# EAGLE design riffle-MIN-D-ROUTED-GOODSTUFF (EAGLE 6.5.0)
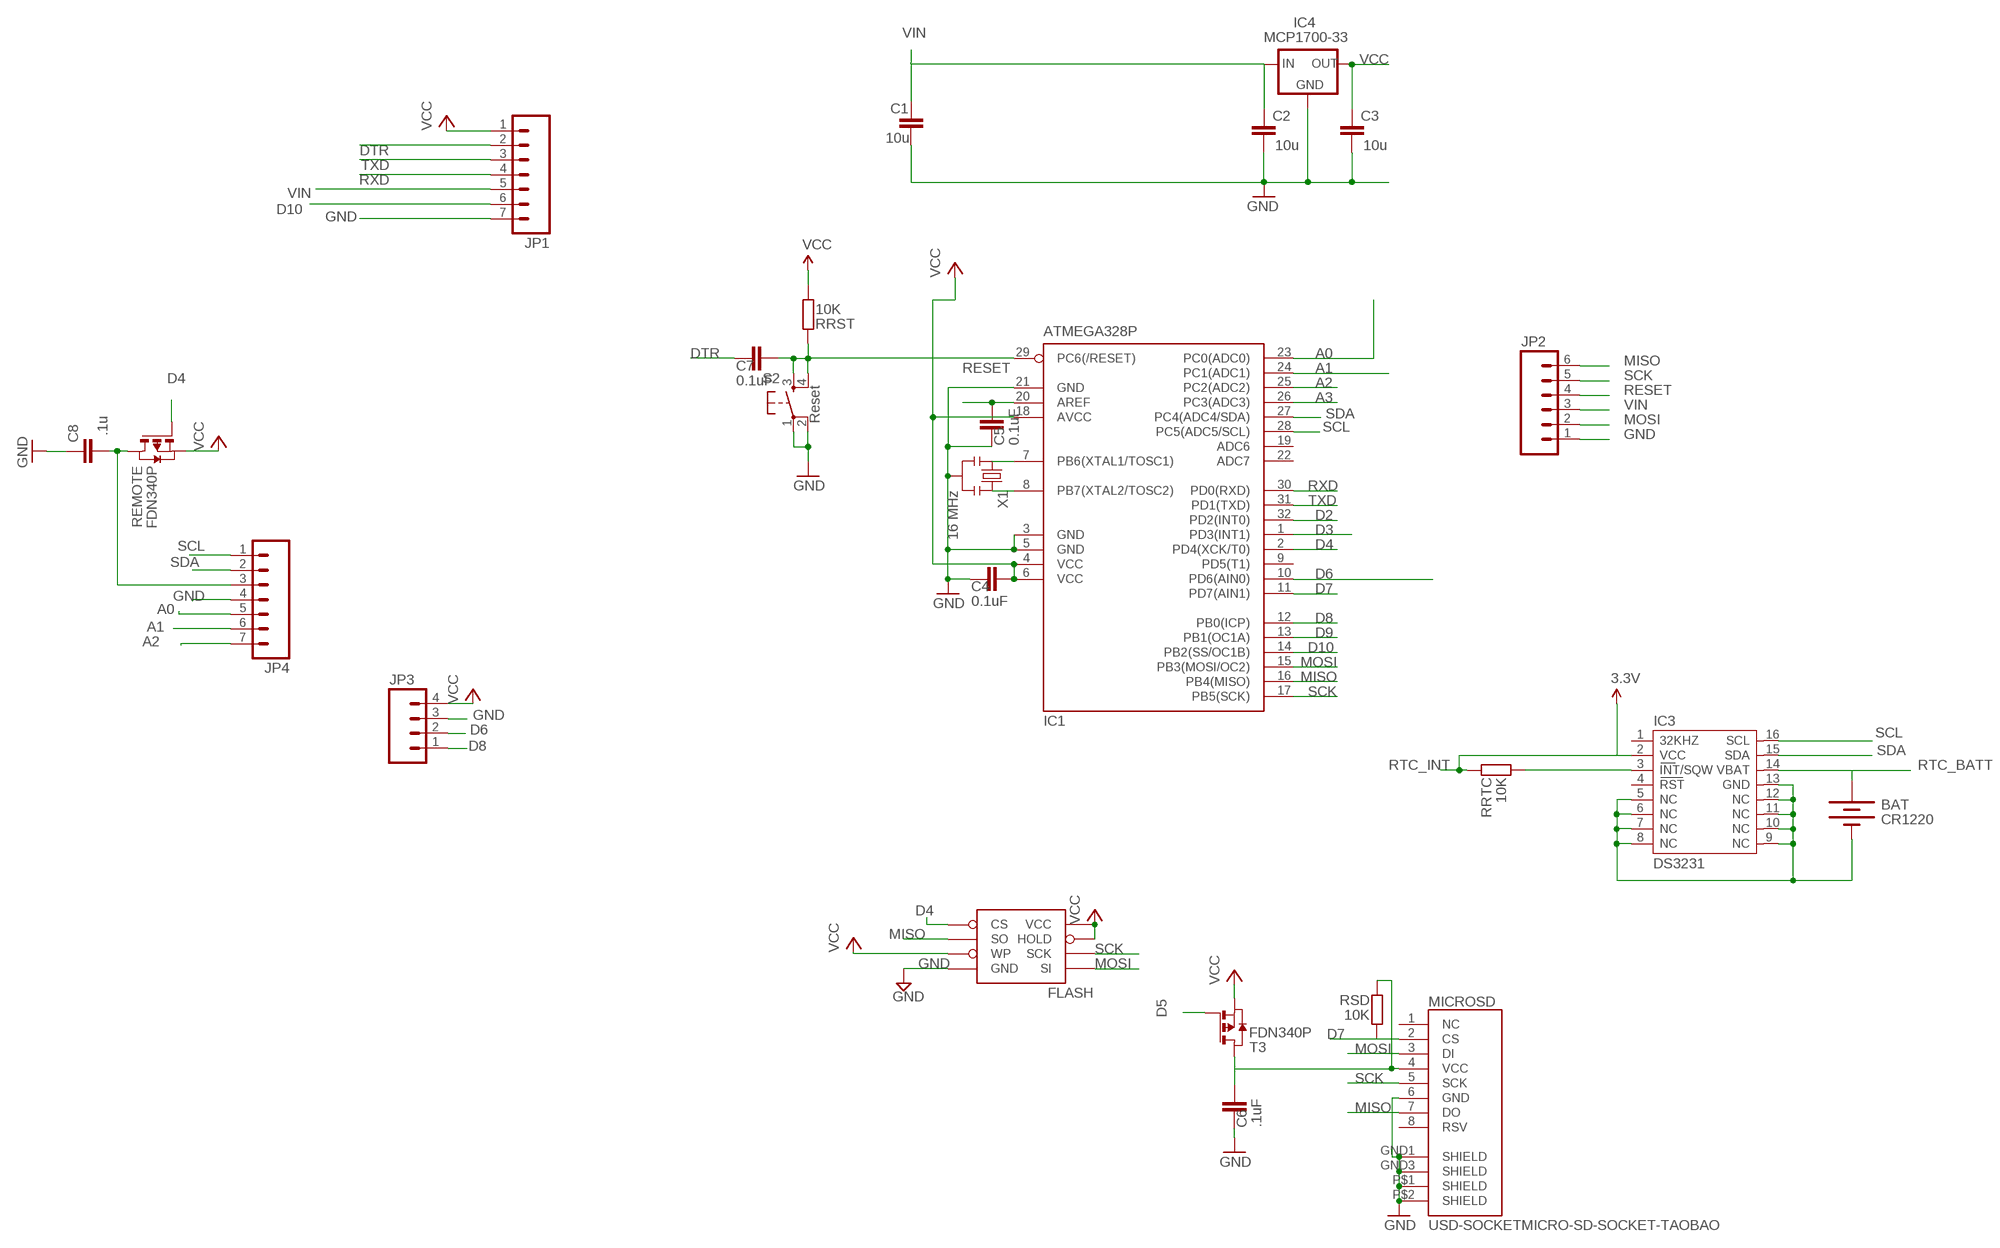
[diagram p0: schematic, sheet 1]

## Parts
BAT  CR1220  BATTERYBATTERY_12MM_SMT  [BATTCON_12MM_SMT]
C1  10u  C-EUC0805  [C0805]
C2  10u  C-EUC0805  [C0805]
C3  10u  C-EUC0805  [C0805]
C4  0.1uF  C-EUC0805  [C0805@1]
C5  0.1uF  C-EUC0805  [C0805@1]
C6  .1uF  C-EUC0805  [C0805@1]
C7  0.1uF  C-EUC0805  [C0805@1]
C8  .1u  C-EUC0805  [C0805]
FLASH  AT25F512BWIDE_5.3MM  [SO08WIDE]
IC1  ATMEGA328P  MEGA8-AI  [TQFP32-08]
IC3  DS3231  [DS3231]
IC4  MCP1700-33  MCP1700SOT233  [SOT23]
JP1  M07  [1X07]
JP2  M06LOCK  [1X06_LOCK]
JP3  M04LOCK  [1X04_LOCK]
JP4  M07  [1X07]
MICROSD  USD-SOCKETMICRO-SD-SOCKET-TAOBAO  [MICRO-SD-SOCKET-TAOBAO]
REMOTE  FDN340P  PMOSSOT23  [SOT-23]
RRST  10K  R-EU_R0805  [R0805]
RRTC  10K  R-EU_R0805  [R0805]
RSD  10K  R-EU_R0805  [R0805]
S2  Reset  TAC_SWITCHSMD  [TACTILE_SWITCH_SMD]
T3  FDN340P  PMOSSOT23  [SOT-23]
X1  16 MHz  RESONATORSMD  [RESONATOR-SMD]

## Nets
A0: IC1.23(PC0(ADC0)) JP4.5
A1: IC1.24(PC1(ADC1)) JP4.6
A2: IC1.25(PC2(ADC2)) JP4.7
A3: IC1.26(PC3(ADC3))
AREF: C5.2 IC1.20(AREF)
D2: IC1.32(PD2(INT0))
D3: IC1.1(PD3(INT1))
D4: FLASH.1(CS) IC1.2(PD4(XCK/T0)) REMOTE.3(G)
D5: T3.3(G)
D6: IC1.10(PD6(AIN0)) JP3.2
D7: IC1.11(PD7(AIN1)) MICROSD.2(CS) RSD.1
D8: IC1.12(PB0(ICP)) JP3.1
D9: IC1.13(PB1(OC1A))
D10: IC1.14(PB2(SS/OC1B)) JP1.6
DTR: C7.1 JP1.2
GND: BAT.P$1(-) C1.2 C2.2 C3.2 C4.1 C5.1 C6.1 C8.1 FLASH.4(GND) IC1.3(GND) IC1.5(GND) IC1.21(GND) IC3.5(NC) IC3.6(NC) IC3.7(NC) IC3.8(NC) IC3.9(NC) IC3.10(NC) IC3.11(NC) IC3.12(NC) IC3.13(GND) IC4.1(GND) JP1.7 JP2.1 JP3.3 JP4.4 MICROSD.6(GND) MICROSD.GND1(SHIELD) MICROSD.GND3(SHIELD) MICROSD.P$1(SHIELD) MICROSD.P$2(SHIELD) S2.1 S2.2 X1.2
MISO: FLASH.2(SO) IC1.16(PB4(MISO)) JP2.6 MICROSD.7(DO)
MOSI: FLASH.5(SI) IC1.15(PB3(MOSI/OC2)) JP2.2 MICROSD.3(DI)
N$2: IC1.8(PB7(XTAL2/TOSC2)) X1.3
N$3: IC1.7(PB6(XTAL1/TOSC1)) X1.1
N$16: IC3.3(INT/SQW) RRTC.1
N$31: C6.2 MICROSD.4(VCC) RSD.2 T3.1(D)
RESET: IC1.29(PC6(/RESET)) JP2.4
RESET1: C7.2 RRST.2 S2.3 S2.4
RTC_BATT: BAT.P$2(+) IC3.14(VBAT)
RTC_INT: IC3.2(VCC) RRTC.2 ; supply symbol labelled 3.3V
RXD: IC1.30(PD0(RXD)) JP1.4
SCK: FLASH.6(SCK) IC1.17(PB5(SCK)) JP2.5 MICROSD.5(SCK)
SCL: IC1.28(PC5(ADC5/SCL)) IC3.16(SCL) JP4.1
SDA: IC1.27(PC4(ADC4/SDA)) IC3.15(SDA) JP4.2
TXD: IC1.31(PD1(TXD)) JP1.3
VCC: C3.1 C4.2 C8.2 FLASH.3(WP) FLASH.7(HOLD) FLASH.8(VCC) IC1.4(VCC) IC1.6(VCC) IC1.18(AVCC) IC4.2(OUT) JP1.1 JP3.4 JP4.3 REMOTE.1(D) REMOTE.2(S) RRST.1 T3.2(S)
VIN [power]: C1.1 C2.1 IC4.3(IN) JP1.5 JP2.3
Unconnected: IC1.9(PD5(T1)) IC1.19(ADC6) IC1.22(ADC7) IC3.1(32KHZ) IC3.4(RST) MICROSD.1(NC) MICROSD.8(RSV)

## Library data of the parts
BAT = SparkFunNew:BATTERY: Battery Holders Various common sizes : AA, AAA, 20mm coin cell and 12mm coin cell.
C1-C3 C8 = resistor:C-EU: CAPACITOR, European symbol
C4-C7 = rcl:C-EU: CAPACITOR, European symbol
FLASH = LowPowerLab:AT25F512B: 4-Mbit SPI flash memory
IC1 = atmel:MEGA8: MICROCONTROLLER 8 Kbytes FLASH, 1 kbytes SRAM, 512 bytes EEPROM, USART, 6-channel 10 bit ADC, 2-channel 8 bit ADC Pin compatible with Atmega48, ATMega88, ATMega168 Source: avr.lbr; MPN: ATMEGA8-16AU; OC_FARNELL: 9171371; OC_NEWARK: 73M8863
IC3 = _lh-library:DS3231
IC4 = adafruit:MCP1700: VOLTAGE REGULATOR
JP1 JP4 = SparkFun-Connectors:M07: Header 7 Standard 7-pin 0.1" header. Use with straight break away headers (SKU : PRT-00116), right angle break away headers (PRT-00553), swiss pins (PRT-00743), machine pins (PRT-00117), and female headers (PRT-00115). NOTES ON THE VARIANTS LOCK and LOCK_LONGPADS... This footprint was designed to help hold the alignment of a through-hole component (i.e. 7-pin header) while soldering it into place. You may notice that each hole has been shifted either up or down by 0.005 of an inch from it's more standard position (which is usually a perfectly straight line). This slight alteration caused the pins (the squares in the middle) to touch the edges of the holes. Because they are alternating, it causes a "brace" to hold the header in place. 0.005 has proven to be the perfect amount of "off-center" position when using our standard breakaway headers. Although looks a little odd when you look at the bare footprint, once you have a header in there, the alteration is very hard to notice. Also, if you push a header all the way into place, it is covered up entirely on the bottom side. This idea of altering the position of holes to aid alignment will be further integrated into the Sparkfun Library for other footprints. It can help hold any component with 3 or more connection pins.
JP2 = SparkFun-Connectors:M06: Header 6 Standard 6-pin 0.1" header. Use with straight break away headers (SKU : PRT-00116), right angle break away headers (PRT-00553), swiss pins (PRT-00743), machine pins (PRT-00117), and female headers (PRT-00115). Molex polarized connector foot print use with SKU : PRT-08094 with associated crimp pins and housings. NOTES ON THE VARIANTS LOCK and LOCK_LONGPADS... This footprint was designed to help hold the alignment of a through-hole component (i.e. 6-pin header) while soldering it into place. You may notice that each hole has been shifted either up or down by 0.005 of an inch from it's more standard position (which is a perfectly straight line). This slight alteration caused the pins (the squares in the middle) to touch the edges of the holes. Because they are alternating, it causes a "brace" to hold the component in place. 0.005 has proven to be the perfect amount of "off-center" position when using our standard breakaway headers. Although looks a little odd when you look at the bare footprint, once you have a header in there, the alteration is very hard to notice. Also,if you push a header all the way into place, it is covered up entirely on the bottom side. This idea of altering the position of holes to aid alignment will be further integrated into the Sparkfun Library for other footprints. It can help hold any component with 3 or more connection pins.
JP3 = SparkFun-Connectors:M04: Header 4 Standard 4-pin 0.1" header. Use with straight break away headers (SKU : PRT-00116), right angle break away headers (PRT-00553), swiss pins (PRT-00743), machine pins (PRT-00117), and female headers (PRT-00115). Molex polarized connector foot print use with SKU : PRT-08231 with associated crimp pins and housings. 1MM SMD Version SKU: PRT-10208
MICROSD = SparkFunNew:USD-SOCKET: microSD Socket Push-push type uSD socket. Schematic element and footprint production proven. Spark Fun Electronics SKU : PRT-00127. tDoc lines correctly indicate media card edge positions when inserting (unlocked, locked, depressed).
REMOTE T3 = zetex:PMOSSOT23: MOS FET
RRST RRTC RSD = rcl:R-EU_: RESISTOR, European symbol
S2 = SparkFun:TAC_SWITCH: Momentary Switch Button commonly used for reset or general input. Spark Fun Electronics SKU : COM-00097
X1 = SparkFun:RESONATOR: Resonator Small SMD resonator. This is the itty bitty 10/20MHz resonators with built in caps. CSTCE10M0G55 and CSTCE20M0V53. Footprint has been reviewed closely but hasn't been tested yet.

## Net classes
1 power: width 0.381 mm, clearance 0.254 mm

## Board
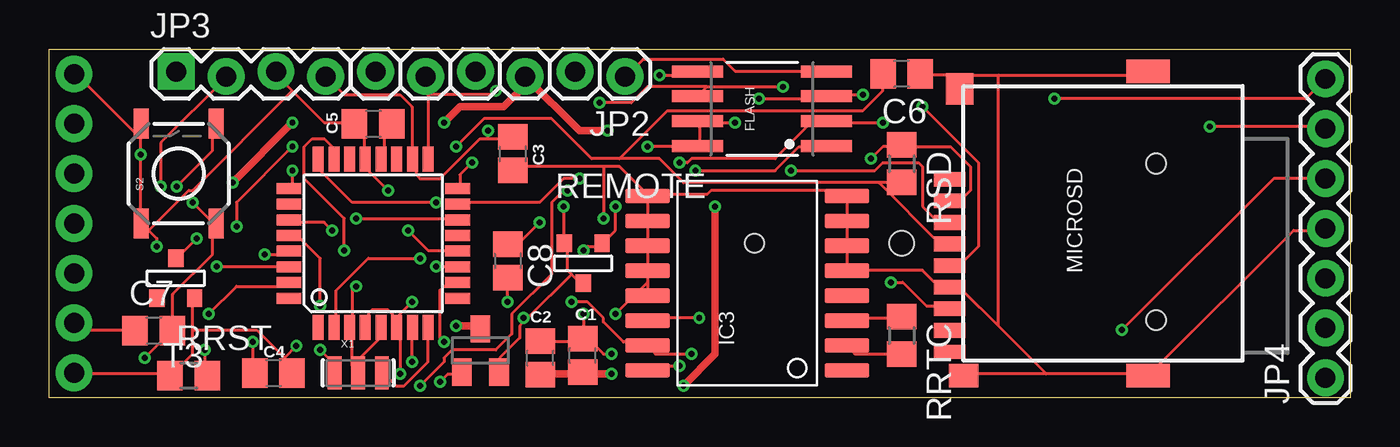
[diagram p1: board, top side]
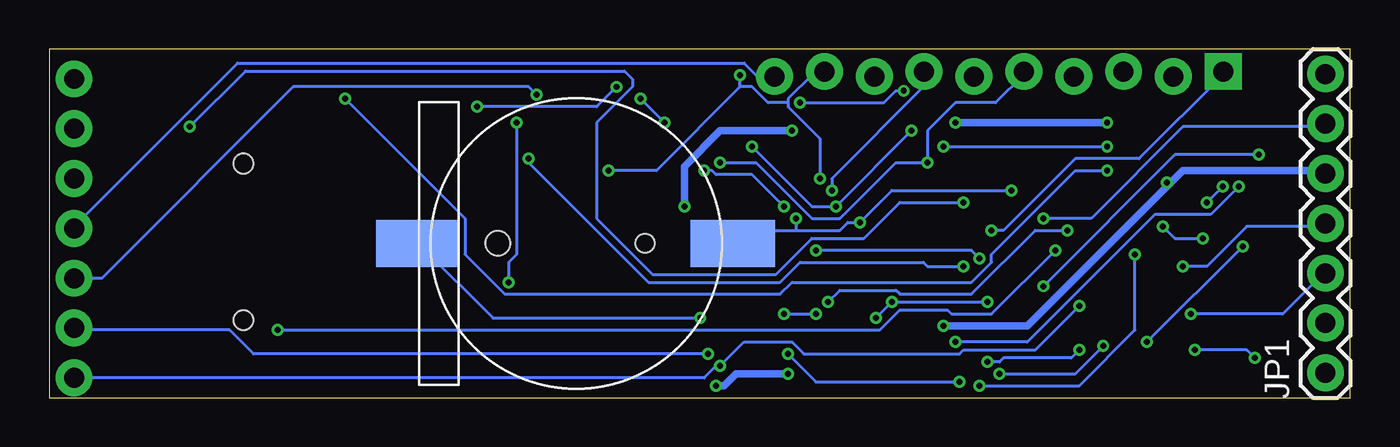
[diagram p2: board, bottom side, seen from below]

Size 66.29 x 17.78 mm. Coordinates in mm from the lower left corner, seen from the top.
Outline: 0,0 0,17.78 66.29,17.78 66.29,0 0,0
Copper layers (1*16): Top 0.035mm / dielectric 1.5mm / Bottom 0.035mm
Design rules "Fusion_eagle_rule_v1.1 *": minimum track width 6mil, minimum drill 12mil, track to track 6mil, track to pad 6mil, pad to pad 6mil, via to via 6mil, smd to smd 0mil, copper to edge 10mil, drill to drill 10mil, minimum pad ring 10mil, minimum via ring 6mil, stop-mask expansion 2mil, vias tented up to drill 100mil, thermal gap 25mil

### Footprints (pad centres in the part's own frame; a part is rotated, then mirrored left to right if it is on the bottom)
BATTCON_12MM_SMT = smd 2.4 x 4.3: P$1 0,11.96 | smd 2.4 x 4.2: P$2 0,-4.1 | hole 0.95: 0,7.5 | hole 1.25: 0,0
C0805 = smd 1.3 x 1.5: 1 -0.85,0; 2 0.85,0
C0805@1 = smd 1.3 x 1.5: 1 -0.95,0; 2 0.95,0
SO08WIDE = smd 0.61 x 2.6: 1 -1.905,-3.269; 2 -0.635,-3.269; 3 0.635,-3.269; 4 1.905,-3.269; 5 1.905,3.286; 6 0.635,3.286; 7 -0.635,3.286; 8 -1.905,3.286
TQFP32-08 = smd 1.27 x 0.559: 1 -4.293,2.8; 2 -4.293,2; 3 -4.293,1.2; 4 -4.293,0.4; 5 -4.293,-0.4; 6 -4.293,-1.2; 7 -4.293,-2; 8 -4.293,-2.8; 17 4.293,-2.8; 18 4.293,-2; 19 4.293,-1.2; 20 4.293,-0.4; 21 4.293,0.4; 22 4.293,1.2; 23 4.293,2; 24 4.293,2.8 | smd 0.559 x 1.27: 9 -2.8,-4.293; 10 -2,-4.293; 11 -1.2,-4.293; 12 -0.4,-4.293; 13 0.4,-4.293; 14 1.2,-4.293; 15 2,-4.293; 16 2.8,-4.293; 25 2.8,4.293; 26 2,4.293; 27 1.2,4.293; 28 0.4,4.293; 29 -0.4,4.293; 30 -1.2,4.293; 31 -2,4.293; 32 -2.8,4.293
DS3231 = smd 0.762 x 2.286: 1 -4.445,-5.08; 2 -3.175,-5.08; 3 -1.905,-5.08; 4 -0.635,-5.08; 5 0.635,-5.08; 6 1.905,-5.08; 7 3.175,-5.08; 8 4.445,-5.08; 9 4.445,5.08; 10 3.175,5.08; 11 1.905,5.08; 12 0.635,5.08; 13 -0.635,5.08; 14 -1.905,5.08; 15 -3.175,5.08; 16 -4.445,5.08
SOT23 = smd 1 x 1.4: 1 -0.95,-1.1; 2 0.95,-1.1; 3 0,1.1
1X07 = drill 1.016 pad 1.88: 1 0,0; 2 2.54,0; 3 5.08,0; 4 7.62,0; 5 10.16,0; 6 12.7,0; 7 15.24,0
1X06_LOCK = drill 1.016 pad 1.88: 1 0,0; 2 2.54,-0.254; 3 5.08,0; 4 7.62,-0.254; 5 10.16,0; 6 12.7,-0.254
1X04_LOCK = drill 1.016 pad 1.88 square: 1 0,0.127 | drill 1.016 pad 1.88: 2 2.54,-0.127; 3 5.08,0.127; 4 7.62,-0.127
MICRO-SD-SOCKET-TAOBAO = smd 0.75 x 1.6: 1 2.25,10.5; 2 1.15,10.5; 3 0.05,10.5; 4 -1.05,10.5; 5 -2.15,10.5; 6 -3.25,10.5; 7 -4.35,10.5; 8 -5.45,10.5 | smd 0.7 x 1.6: CD -6.55,10.5 | smd 1.2 x 1.5: GND1 -7.75,9.8 | smd 1.6 x 1.4: GND3 6.85,10 | smd 1.2 x 2.2: P$1 7.75,0.4; P$2 -7.75,0.4 | hole 1: 3.05,0; -4.93,0
SOT-23 = smd 0.787 x 0.889: 1 0.025,-1.016; 2 -0.94,1.016; 3 0.991,1.016
R0805 = smd 1.3 x 1.5: 1 -0.95,0; 2 0.95,0
TACTILE_SWITCH_SMD = smd 1.524 x 0.762: 1 -2.54,1.905; 2 2.54,1.905; 3 -2.54,-1.905; 4 2.54,-1.905
RESONATOR-SMD = smd 0.7 x 1.7: 1 -1.2,0; 2 0,0; 3 1.2,0

### Placement (x,y rotation side)
BAT  43.43,7.87 270 bottom
C1  27.18,2.16 90 top
C2  25.02,2.03 90 top
C3  23.62,12.45 270 top
C4  11.43,1.27 0 top
C5  16.51,13.97 0 top
C6  43.43,16.51 180 top
C7  5.33,3.43 0 top
C8  23.37,6.99 270 top
FLASH  36.32,14.73 90 top
IC1  16.51,7.87 90 top
IC3  35.56,5.84 90 top
IC4  21.97,2.41 0 top
JP1  1.27,1.27 90 bottom
JP2  29.34,16.38 180 top
JP3  6.48,16.51 0 top
JP4  65.02,1.02 90 top
MICROSD  56.39,8.89 90 top
REMOTE  27.18,6.86 0 top
RRST  7.11,1.14 0 top
RRTC  43.43,3.17 270 top
RSD  43.43,11.94 270 top
S2  6.6,11.43 90 top
T3  6.48,6.1 180 top
X1  15.75,1.27 0 top

### Tracks (layer width: path | path; a pad name or v marks a point on that pad's centre or on a via)
A0  (via drill 0.3)
  Top 0.152: v15.04,7.52 15.04,9.14 13.01,11.18 13.01,12.8 13.41,13.21 14.02,13.21 14.43,12.8 14.43,12.19 IC1.23 | v54.66,3.45 62.38,11.18 JP4.5
  Bottom 0.152: v15.04,7.52 18.29,4.27 20.32,4.27 20.52,4.47 22.96,4.47 23.98,3.45 v54.66,3.45
A1  (via drill 0.3)
  Top 0.152: v19.71,9.96 15.44,9.96 13.82,11.58 13.82,11.99 IC1.24 | v59.13,13.82 65.02,13.82 JP4.6
  Bottom 0.152: v19.71,9.96 22.96,9.96 24.79,8.13 27.43,8.13 29.26,6.3 35.56,6.3 38.41,9.14 38.41,14.02 36.58,15.85 36.58,16.26 36.98,16.66 56.29,16.66 v59.13,13.82
A2  (via drill 0.3)
  Top 0.152: v12.39,11.58 12.39,10.77 IC1.25 | v51.21,15.24 64.01,15.24 JP4.7
  Bottom 0.152: v12.39,11.58 14.02,11.58 18.29,7.32 18.29,6.91 19.3,5.89 28.45,5.89 29.06,5.28 43.08,5.28 45.11,7.32 45.11,9.14 v51.21,15.24
AREF
  Top 0.152: IC1.20 17.07,12.19 17.07,13.61 17.27,13.82 C5.2
D4  (via drill 0.3)
  Top 0.152: v27.23,7.52 27.43,7.72 28.04,7.72 REMOTE.3 28.25,7.92 28.85,8.53 v28.85,9.75 | v18.9,7.11 16.26,7.11 14.63,5.49 14.63,3.66 IC1.2 | v32.92,11.58 36.98,11.58 38.2,12.8 39.42,12.8 FLASH.1
  Bottom 0.152: v27.23,7.52 19.3,7.52 v18.9,7.11 | v32.92,11.58 32.51,11.58 32.31,11.38 30.48,11.38 v28.85,9.75
D6  (via drill 0.3)
  Top 0.152: v20.12,2.85 19.91,3.05 19.91,5.49 20.12,5.69 20.73,5.69 IC1.10 | v5.69,10.77 5.69,13.01 8.94,16.26 JP3.2
  Bottom 0.152: v20.12,2.85 16.46,2.85 9.96,9.35 7.11,9.35 v5.69,10.77
D7  (via drill 0.3)
  Top 0.152: v19.71,6.71 20.73,6.71 IC1.11 | v41.86,12.19 42.47,12.8 43.28,12.8 RSD.1 43.48,12.8 45.92,12.8 46.94,11.79 46.94,10.57 46.53,10.16 45.92,10.16 MICROSD.2
  Bottom 0.152: v19.71,6.71 21.54,6.71 21.74,6.91 28.04,6.91 29.06,5.89 35.76,5.89 41.86,11.99 v41.86,12.19
D8  (via drill 0.3)
  Top 0.152: v18.29,8.53 19.3,7.52 20.73,7.52 IC1.12
  Bottom 0.152: v18.29,8.53 17.68,8.53 14.02,12.19 10.77,12.19 6.5,16.46 JP3.1
D10  (via drill 0.3)
  Top 0.152: v15.65,9.14 20.73,9.14 IC1.14
  Bottom 0.152: v15.65,9.14 13.21,9.14 8.53,13.82 1.42,13.82 JP1.6
DTR
  Top 0.152: JP1.2 1.63,3.45 4.27,3.45 C7.1
GND  (via drill 0.3)
  Top 0.152: 12.39,15.65 11.58,16.46 JP3.3 | 12.39,15.65 14.02,14.02 15.44,14.02 C5.1 15.65,13.82 16.05,13.41 16.05,12.19 IC1.21 16.26,11.99 16.26,11.58 v17.27,10.57 | 15.44,1.63 15.44,3.45 IC1.3 15.44,3.66 15.44,5.49 v15.65,5.69 | 15.44,1.63 15.65,1.42 X1.2 15.44,1.63 | 15.44,1.63 16.87,3.05 16.87,3.45 IC1.5 | v10.36,2.85 10.36,1.42 C4.1 | v5.49,7.72 5.49,8.13 5.08,8.53 | 5.08,8.53 4.88,8.74 S2.1 4.67,8.94 v4.67,12.39 4.67,13.21 | 4.67,13.21 4.67,13.82 S2.2 | 4.67,13.21 1.42,16.46 JP1.7 | 12.39,15.65 7.32,10.57 7.11,10.57 5.08,8.53 | v24.99,8.94 23.98,7.92 23.37,7.92 C8.1 | v19.91,0.81 20.32,1.22 20.93,1.22 IC4.1 | v28.65,2.23 28.25,2.23 27.64,2.85 27.23,2.85 C1.2 | C2.2 25.2,2.85 27.03,2.85 C1.2 | 30.48,5.89 IC3.12 IC3.11 IC3.10 IC3.9 30.48,10.36 | 30.48,5.89 IC3.13 | 28.25,11.79 29.06,11.79 30.48,10.36 | 28.25,11.79 23.77,11.79 C3.2 | v27.23,4.27 27.23,3.05 C1.2 | 30.48,5.89 v28.85,4.27 | 28.25,11.79 v28.25,9.14 | FLASH.4 39.42,16.66 34.95,16.66 34.34,17.27 30.28,17.27 29.46,16.46 JP2.1 | 45.72,16.46 44.5,16.46 C6.1 | 45.72,16.46 46.33,15.85 MICROSD.GND3 45.72,16.46 | 45.72,16.46 48.36,16.46 | 48.36,16.46 55.88,16.46 MICROSD.P$1 | 40.64,6.5 IC3.6 IC3.7 IC3.8 40.64,10.36 40.44,10.57 33.73,10.57 33.53,10.36 30.48,10.36 | 50.8,1.22 55.88,1.22 MICROSD.P$2 56.08,1.22 63.4,8.53 65.02,8.53 JP4.4 | 50.8,1.22 46.74,1.22 MICROSD.GND1 | 50.8,1.22 48.36,3.66 | 48.36,3.66 46.53,5.49 45.92,5.49 MICROSD.6 45.72,5.69 45.31,5.69 44.5,6.5 40.64,6.5 | 40.64,6.5 IC3.5 | 48.36,3.66 48.36,16.46
  Bottom 0.152: v5.49,7.72 v10.36,2.85 | v15.65,5.69 8.94,12.39 v4.67,12.39 | 28.25,8.53 30.68,8.53 31.29,7.92 BAT.P$1 | 28.25,8.53 26.01,8.53 25.6,8.94 v24.99,8.94 23.37,10.57 v17.27,10.57 | v19.91,0.81 27.23,0.81 v28.65,2.23 | v28.85,4.27 v27.23,4.27 | v28.25,9.14 28.25,8.53 | JP2.1 29.46,16.46 30.28,16.46 30.89,17.07 56.69,17.07 65.02,8.74 JP4.4
MISO  (via drill 0.3)
  Top 0.152: v21.54,11.99 20.93,11.38 20.93,10.77 IC1.16 | v42.88,5.89 43.48,5.89 44.7,4.67 45.72,4.67 MICROSD.7 | v42.47,14.02 39.62,14.02 FLASH.2 39.42,14.02 38.81,14.02 36.98,12.19 32.72,12.19 32.51,11.99 v32.11,11.99
  Bottom 0.152: JP2.6 16.66,16.46 18.09,15.04 20.12,15.04 21.54,13.61 v21.54,11.99 23.16,11.99 26.01,9.14 27.43,9.14 30.28,11.99 v32.11,11.99 | v42.88,5.89 42.88,6.91 42.47,7.32 v42.47,14.02
MOSI  (via drill 0.3)
  Top 0.152: v27.03,11.18 26.21,11.18 24.99,9.96 20.93,9.96 IC1.15 | v37.8,11.58 42.06,11.58 42.47,11.99 44.3,11.99 44.5,11.79 44.5,9.75 45.31,8.94 45.72,8.94 MICROSD.3 | v31.09,16.46 32.92,16.46 FLASH.5
  Bottom 0.152: v27.03,11.18 27.03,13.21 28.65,14.83 28.65,15.04 | 28.65,15.04 28.65,15.24 27.43,16.46 26.82,16.46 JP2.2 | v37.8,11.58 35.36,11.58 31.09,15.85 | 31.09,15.85 30.48,15.85 29.67,15.04 28.65,15.04 | 31.09,15.85 v31.09,16.46
N$2
  Top 0.152: IC1.8 19.3,3.45 19.3,1.83 18.09,0.61 17.68,0.61 17.07,1.22 X1.3
N$3  (via drill 0.3)
  Top 0.152: v18.49,1.83 18.49,3.45 IC1.7 | v13.82,2.44 14.43,1.83 14.43,1.42 X1.1
  Bottom 0.152: v18.49,1.83 17.88,1.83 17.68,2.03 14.22,2.03 v13.82,2.44
N$16
  Top 0.152: RRTC.1 43.28,4.06 40.64,4.06 IC3.3
N$31  (via drill 0.3)
  Top 0.152: v7.52,8.13 6.5,7.11 T3.1 | v9.55,8.74 9.55,9.96 v12.39,12.8 | v20.73,12.8 22.15,14.22 25.6,14.22 27.64,12.19 29.06,12.19 | 29.06,12.19 31.09,12.19 32.31,10.97 42.27,10.97 | 42.27,10.97 43.28,10.97 RSD.2 | 29.06,12.19 31.5,14.63 41.45,14.63 42.47,15.65 42.47,16.46 C6.2 | 42.27,10.97 45.31,7.92 45.72,7.92 MICROSD.4
  Bottom 0.152: v7.52,8.13 8.94,8.13 v9.55,8.74 | v20.73,12.8 v12.39,12.8
RESET  (via drill 0.3)
  Top 0.152: v10.97,7.32 12.19,7.32 IC1.29 | v18.9,0.61 20.12,1.83 20.12,2.03 20.52,2.44 22.76,2.44 23.57,3.25 23.57,4.27 25.6,6.3 25.6,9.96 26.21,10.57 v26.42,10.57
  Bottom 0.152: v10.97,7.32 10.97,3.45 13.82,0.61 v18.9,0.61 | v26.42,10.57 26.42,11.18 21.74,15.85 21.74,16.46 JP2.4
RESET1  (via drill 0.3)
  Top 0.152: v7.92,2.44 7.92,1.22 RRST.2 | v4.88,2.03 6.1,3.25 C7.2 6.3,3.45 6.3,5.28 8.33,7.32 8.33,8.74 S2.3 8.33,8.94 v7.32,9.96 | v6.5,10.77 8.33,12.6 8.33,13.82 S2.4
  Bottom 0.152: v7.92,2.44 5.28,2.44 v4.88,2.03 | v7.32,9.96 v6.5,10.77
RTC_BATT  (via drill 0.3)
  Top 0.152: v33.12,4.06 30.48,4.06 IC3.14
  Bottom 0.152: v33.12,4.06 43.69,4.06 47.35,7.72 BAT.P$2
RTC_INT
  Top 0.152: RRTC.2 43.28,2.23 41.05,2.23 40.64,2.64 IC3.2
RXD  (via drill 0.3)
  Top 0.152: v8.53,6.71 12.19,6.71 IC1.30
  Bottom 0.152: v8.53,6.71 7.32,6.71 5.28,8.74 1.42,8.74 JP1.4
SCK  (via drill 0.3)
  Top 0.152: 19.3,15.44 19.3,16.26 JP2.5 | 19.3,15.44 19.3,12.19 IC1.17 | v44.5,14.83 47.35,11.99 47.35,7.72 46.53,6.91 45.92,6.91 MICROSD.5 | 33.53,15.85 v37.39,15.85 | 33.53,15.85 33.12,15.44 FLASH.6 | 19.3,15.44 22.55,15.44 v22.76,15.65 | v28.04,15.04 29.67,15.04 30.48,15.85 33.53,15.85
  Bottom 0.152: v44.5,14.83 38.41,14.83 v37.39,15.85 | v22.76,15.65 23.16,15.65 23.77,15.04 v28.04,15.04
SCL  (via drill 0.3)
  Top 0.152: v13.82,4.67 13.82,7.11 12.8,8.13 12.39,8.13 IC1.28 | v32.11,1.63 30.68,1.63 30.48,1.42 IC3.16
  Bottom 0.152: v13.82,4.67 16.05,2.44 19.71,2.44 19.91,2.23 27.84,2.23 28.45,2.85 30.89,2.85 v32.11,1.63 32.31,1.63 32.92,1.02 JP4.1
SDA  (via drill 0.3)
  Top 0.152: v14.43,8.53 14.02,8.94 12.39,8.94 IC1.27 | v26.62,4.88 27.43,4.88 28.25,4.06 28.25,3.86 29.26,2.85 30.48,2.85 IC3.15 30.48,2.64 30.89,2.23 v32.72,2.23
  Bottom 0.152: v14.43,8.53 16.05,8.53 19.3,5.28 22.96,5.28 23.16,5.49 26.01,5.49 v26.62,4.88 | v32.72,2.23 55.88,2.23 57.1,3.45 65.02,3.45 JP4.2
TXD  (via drill 0.3)
  Top 0.152: v8.13,4.27 9.55,5.69 12.19,5.69 IC1.31
  Bottom 0.152: v8.13,4.27 3.45,4.27 1.42,6.3 JP1.3
VCC  (via drill 0.3)
  Top 0.152: 7.32,3.45 7.32,2.23 6.3,1.22 RRST.1 6.1,1.22 1.42,1.22 JP1.1 | 7.32,3.45 7.32,5.08 T3.2 | 11.99,2.03 10.57,3.45 7.32,3.45 | 11.99,2.03 12.19,1.83 12.19,1.42 C4.2 | 17.68,4.06 17.27,4.47 16.46,4.47 16.26,4.27 16.26,3.66 IC1.4 | 17.68,4.06 17.68,3.66 IC1.6 | 26.62,6.3 27.03,5.89 REMOTE.1 | 26.62,6.3 26.42,6.5 26.42,7.72 REMOTE.2 26.21,7.92 v26.21,9.75 | 26.62,6.3 24.38,4.06 | 24.38,4.06 23.98,3.66 23.98,3.05 22.96,2.03 22.96,1.42 IC4.2 | v23.37,4.88 C8.2 | 24.38,4.06 v24.18,4.06 | v18.49,4.88 17.68,4.06 | 17.68,4.06 IC1.6 | JP3.4 15.04,15.44 17.88,15.44 18.49,14.83 18.49,12.19 IC1.18 18.69,11.99 18.69,11.38 18.9,11.18 19.91,11.18 21.95,13.21 22.35,13.21 | 22.35,13.21 23.57,13.21 C3.1 | 22.35,13.21 v22.35,13.61 | v12.6,2.64 11.99,2.03 | v17.88,1.22 17.88,3.45 IC1.6 | 33.12,14.02 33.12,13.01 FLASH.8 32.92,12.8 v30.48,12.8 | v36.17,15.24 39.42,15.24 FLASH.3 39.62,15.44 v41.45,15.44 | 33.12,14.02 v34.95,14.02 | 33.12,14.02 FLASH.7
  Bottom 0.152: v24.18,4.06 v23.37,4.88 v18.49,4.88 | v22.35,13.61 v26.21,9.75 27.43,9.75 v30.48,12.8 | v12.6,2.64 14.02,1.22 v17.88,1.22 | v34.95,14.02 v36.17,15.24 | JP4.3 63.6,6.1 53.85,15.85 41.86,15.85 v41.45,15.44
VIN  (via drill 0.3)
  Top 0.381: C2.1 25.2,1.22 27.03,1.22 C1.1 27.23,1.22 v28.65,1.22 | v32.31,0.61 33.93,2.23 v33.93,9.75 | v28.45,13.61 27.03,13.61 JP2.3 24.38,16.05 23.16,14.83 20.93,14.83 v20.12,14.02 | v20.73,3.66 21.95,3.66 IC4.3 | v9.35,10.97 v12.39,14.02
  Bottom 0.381: v28.65,1.22 31.29,1.22 31.9,0.61 v32.31,0.61 | v33.93,9.75 33.93,11.79 32.11,13.61 v28.45,13.61 | v20.73,3.66 16.46,3.66 9.25,10.87 | 9.25,10.87 8.53,11.58 1.42,11.58 JP1.5 | v12.39,14.02 v20.12,14.02 | v9.35,10.97 9.25,10.87